# EAGLE schematic controller_old (EAGLE 9.0.0)

## Sheet 1 of 6
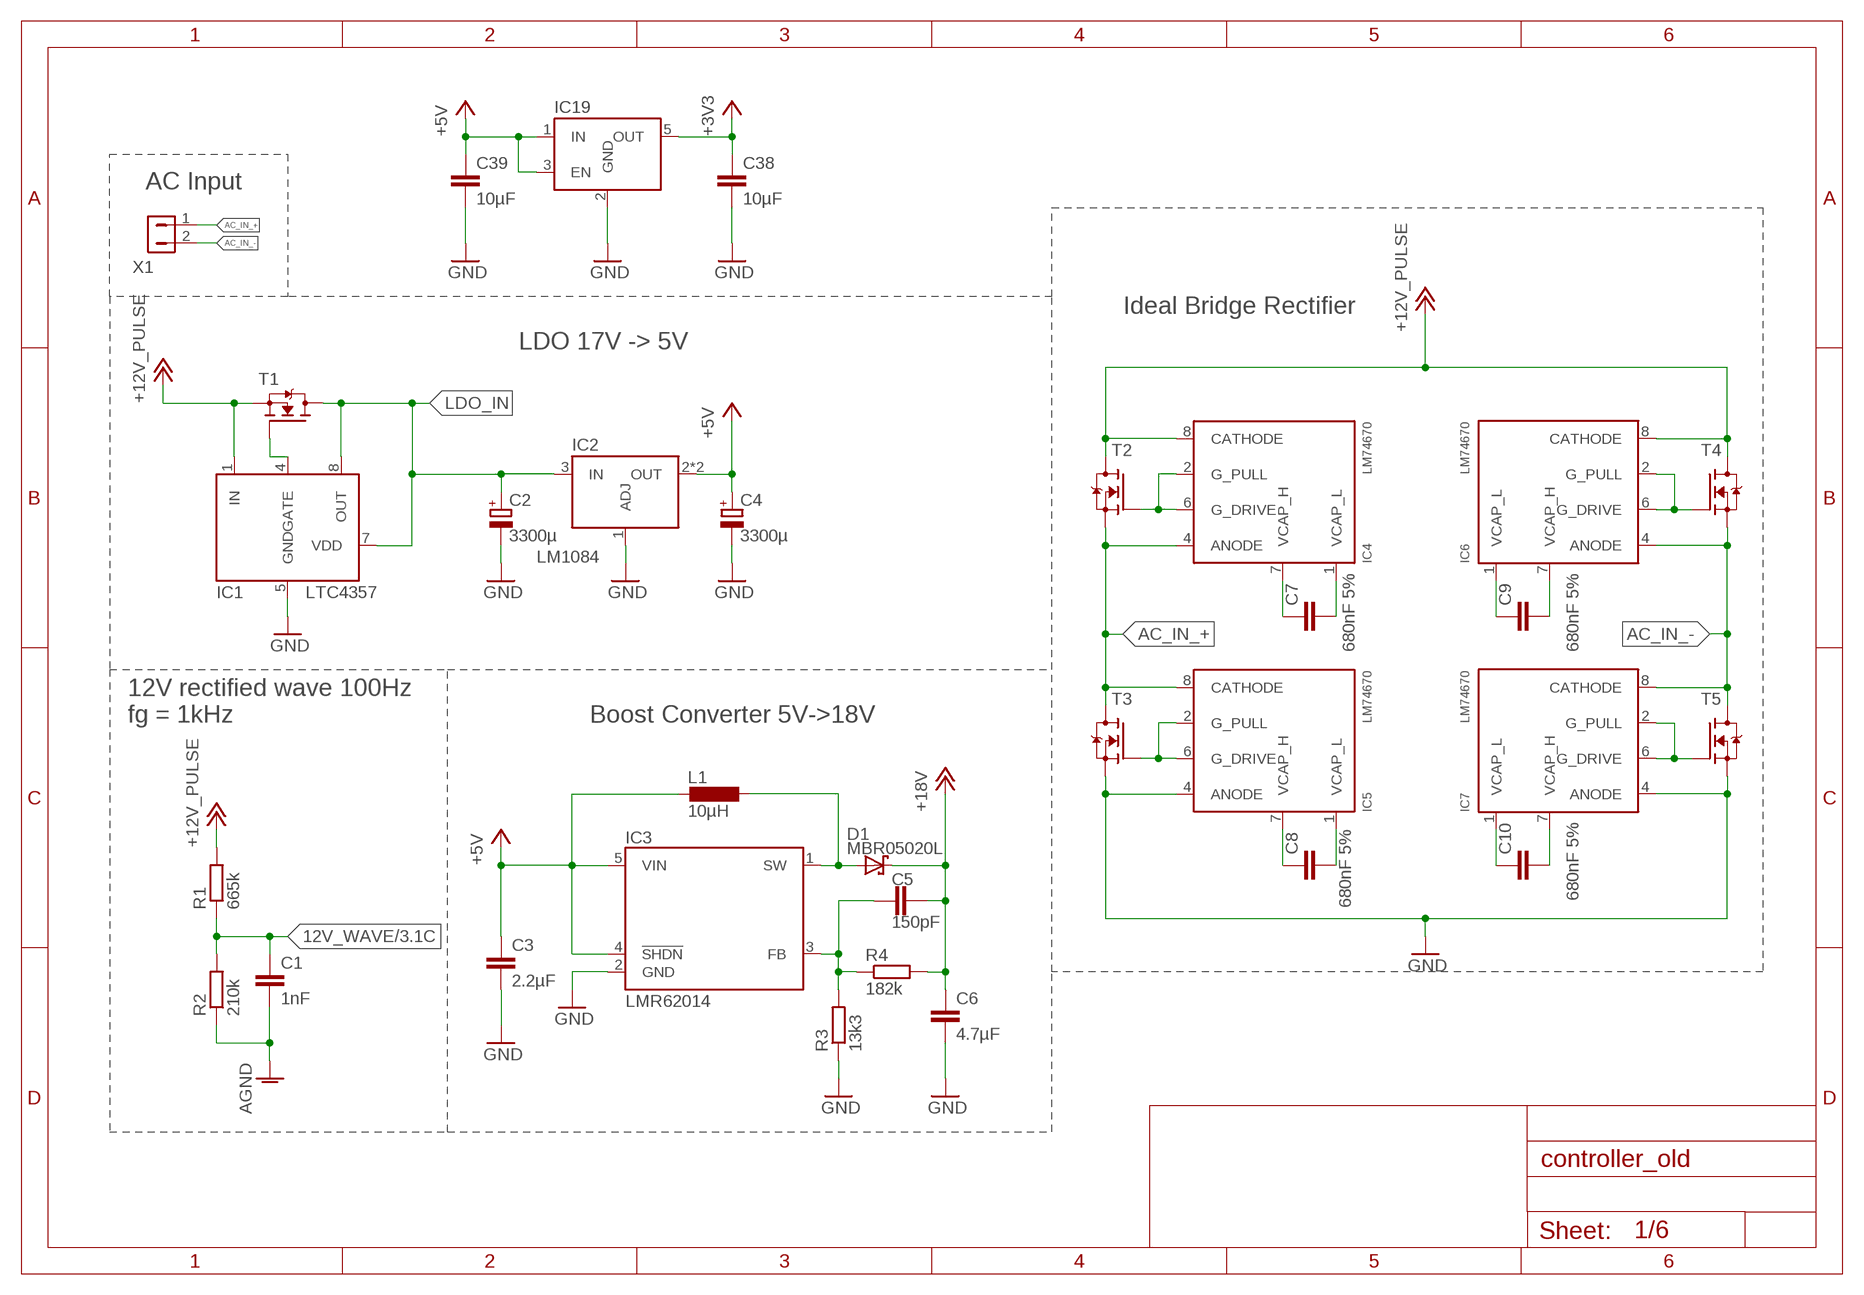
[diagram p0: schematic, sheet 1]

### Parts
C1  1nF  C-EUC0603  [C0603]
C2  3300µ  C-EEVFK  [C_EEVFK]
C3  2.2µF  C-EUC0805  [C0805]
C4  3300µ  C-EEVFK  [C_EEVFK]
C5  150pF  C-EUC0805  [C0805]
C6  4.7µF  C-EUC0805  [C0805]
C7  680nF 5%  C-EUC0805  [C0805]
C8  680nF 5%  C-EUC0805  [C0805]
C9  680nF 5%  C-EUC0805  [C0805]
C10  680nF 5%  C-EUC0805  [C0805]
C38  10µF  C-EUC0805  [C0805]
C39  10µF  C-EUC0805  [C0805]
D1  MBR05020L  [SOD-123]
IC1  LTC4357  [MSOP8]
IC2  LM1084  [TO263]
IC3  LMR62014  [SOT23-5L]
IC4  LM74670  [VSSOP-8]
IC5  LM74670  [VSSOP-8]
IC6  LM74670  [VSSOP-8]
IC7  LM74670  [VSSOP-8]
IC19  MIC5504  [SOT23-5L]
L1  10µH  WE-TPC  [WE-TPC]
R1  665k  R-EU_R0603  [R0603]
R2  210k  R-EU_R0603  [R0603]
R3  13k3  R-EU_R0805  [R0805]
R4  182k  R-EU_R0805  [R0805]
T1  FDS6670A  [SO8]
T2  PSMN1R0  [LFPAK56-5]
T3  PSMN1R0  [LFPAK56-5]
T4  PSMN1R0  [LFPAK56-5]
T5  PSMN1R0  [LFPAK56-5]
X1  ULTRAFIT-20  [ULTRAFIT-2]

### Nets
12V_WAVE: C1.1 R1.1 R2.2 ; also sheet 3
+3V3: C38.1 IC19.5(OUT) ; also sheet 4,6
+5V: C3.1 C4.+ C39.1 IC2.2(OUT) IC2.4(OUT) IC3.4(!SHDN!) IC3.5(VIN) IC19.1(IN) IC19.3(EN) L1.2 ; also sheet 2,3,4,5,6
+12V_PULSE: IC1.1(IN) IC4.8(CATHODE) IC6.8(CATHODE) R1.2 T1.1(S) T1.2(S) T1.3(S) T2.5(D) T4.5(D) ; also sheet 2,4,6
+18V [+18V]: C5.1 C6.1 D1.1(C) R4.2 ; also sheet 2,6
AC_IN_+: IC4.4(ANODE) IC5.8(CATHODE) T2.1(S) T2.2(S) T2.3(S) T3.5(D) X1.1
AC_IN_-: IC6.4(ANODE) IC7.8(CATHODE) T4.1(S) T4.2(S) T4.3(S) T5.5(D) X1.2
AGND: C1.2 R2.1 ; also sheet 3,5
BOOST_FB: C5.2 IC3.3(FB) R3.2 R4.1
BOOST_SW: D1.2(A) IC3.1(SW) L1.1
DIODE_G: IC1.4(GATE) T1.4(G)
GND: C2.- C3.2 C4.- C6.2 C38.2 C39.2 IC1.5(GND) IC2.1(ADJ) IC3.2(GND) IC5.4(ANODE) IC7.4(ANODE) IC19.2(GND) R3.1 T3.1(S) T3.2(S) T3.3(S) T5.1(S) T5.2(S) T5.3(S) ; also sheet 2,3,4,6
LDO_IN: C2.+ IC1.7(VDD) IC1.8(OUT) IC2.3(IN) T1.5(D) T1.6(D) T1.7(D) T1.8(D)
RECT_D1_CAP_H1: C7.1 IC4.7(VCAP_H)
RECT_D1_CAP_L1: C7.2 IC4.1(VCAP_L)
RECT_D1_G1: IC4.2(G_PULL) IC4.6(G_DRIVE) T2.4(G)
RECT_D2_CAP_H1: C9.2 IC6.1(VCAP_L)
RECT_D2_CAP_L1: C9.1 IC6.7(VCAP_H)
RECT_D2_G1: IC6.2(G_PULL) IC6.6(G_DRIVE) T4.4(G)
RECT_D3_CAP_H1: C8.1 IC5.7(VCAP_H)
RECT_D3_CAP_L1: C8.2 IC5.1(VCAP_L)
RECT_D3_G1: IC5.2(G_PULL) IC5.6(G_DRIVE) T3.4(G)
RECT_D4_CAP_H1: C10.2 IC7.1(VCAP_L)
RECT_D4_CAP_L1: C10.1 IC7.7(VCAP_H)
RECT_D4_G1: IC7.2(G_PULL) IC7.6(G_DRIVE) T5.4(G)

### Notes on the sheet
- AC Input
- Ideal Bridge Rectifier
- LDO 17V -> 5V
- 12V rectified wave 100Hz 
  fg = 1kHz
- Boost Converter 5V->18V

## Sheet 2 of 6
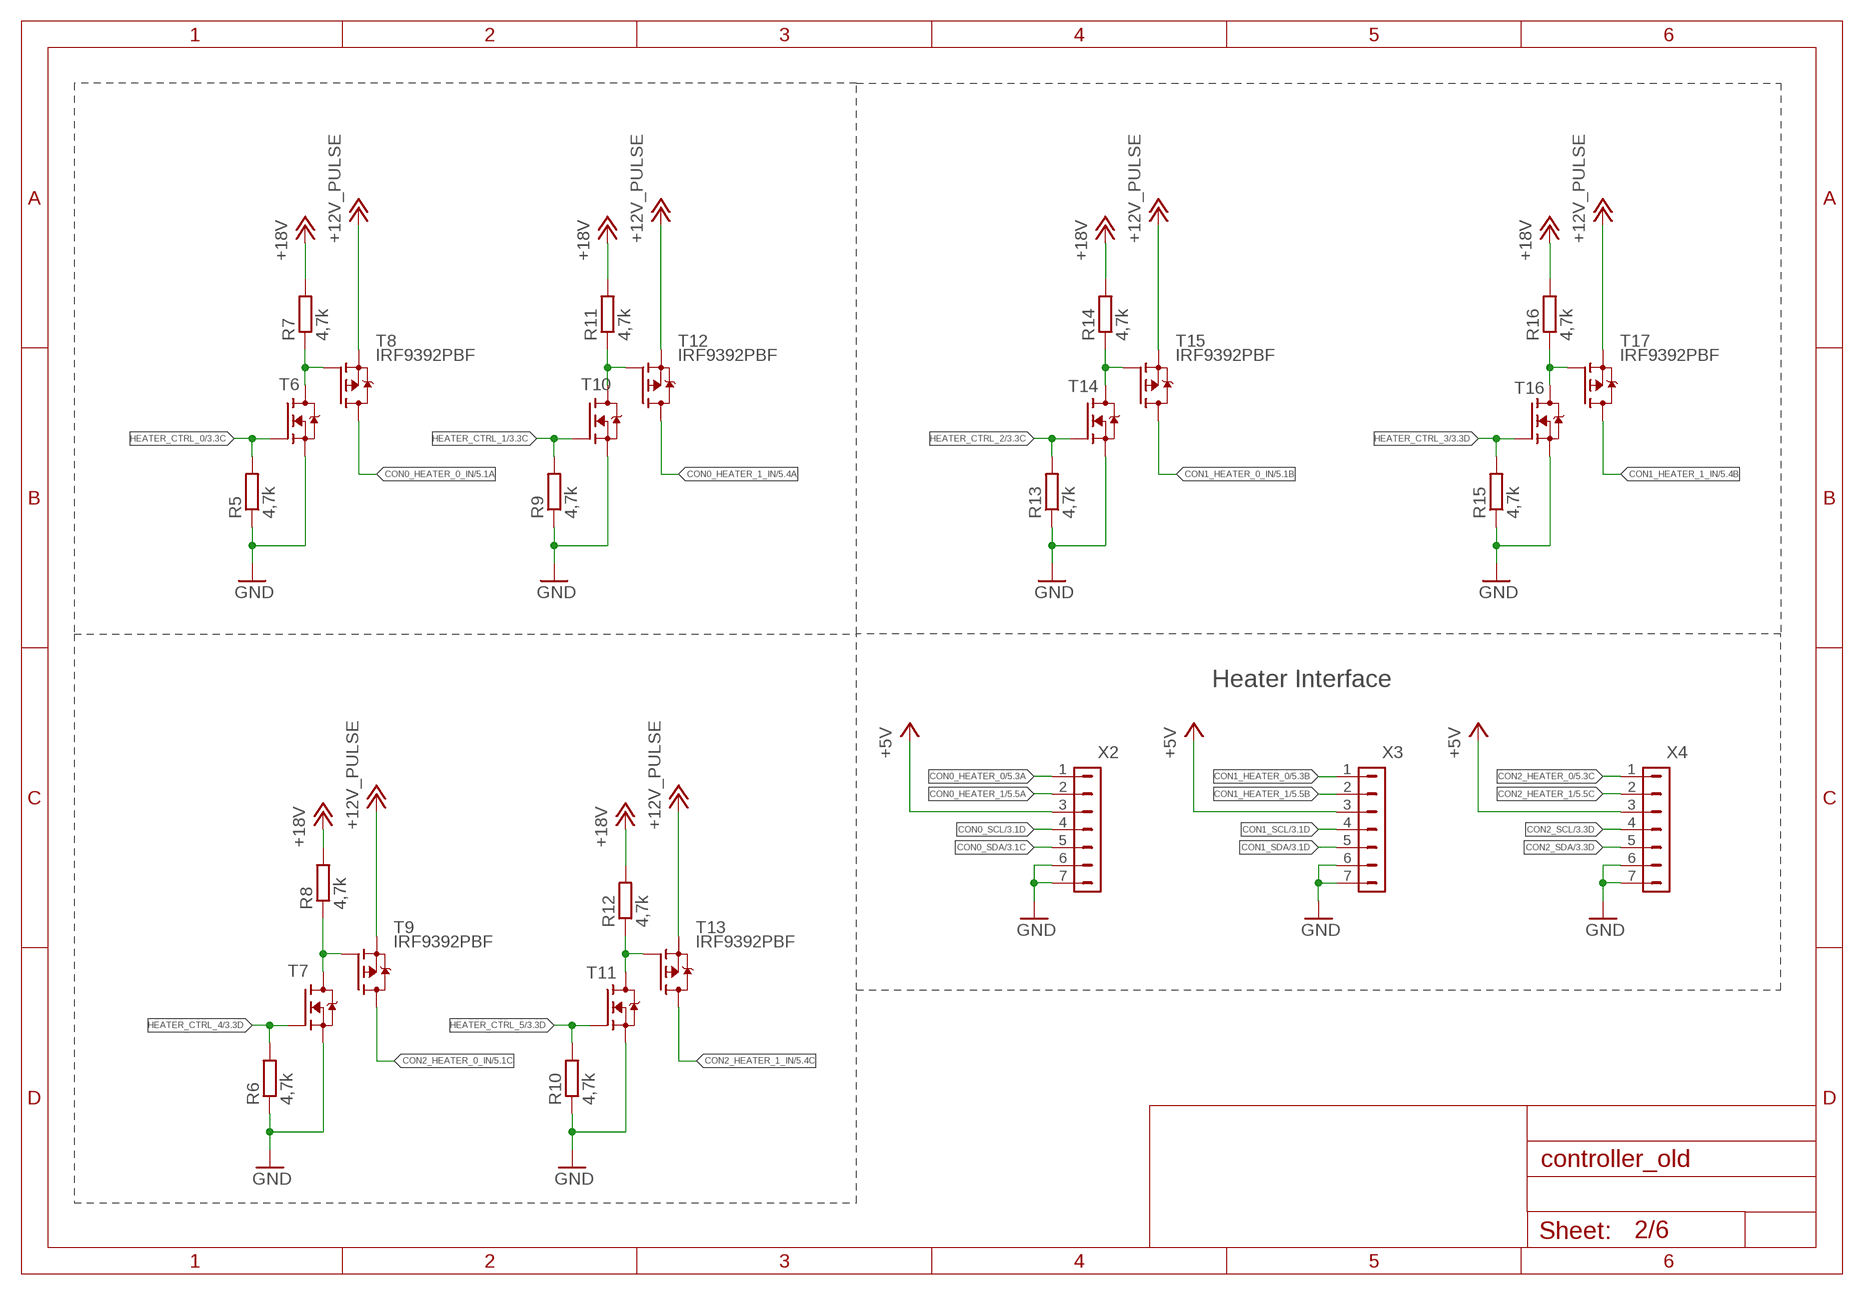
[diagram p1: schematic, sheet 2]

### Parts
R5  4,7k  R-EU_R0805  [R0805]
R6  4,7k  R-EU_R0805  [R0805]
R7  4,7k  R-EU_R0805  [R0805]
R8  4,7k  R-EU_R0805  [R0805]
R9  4,7k  R-EU_R0805  [R0805]
R10  4,7k  R-EU_R0805  [R0805]
R11  4,7k  R-EU_R0805  [R0805]
R12  4,7k  R-EU_R0805  [R0805]
R13  4,7k  R-EU_R0805  [R0805]
R14  4,7k  R-EU_R0805  [R0805]
R15  4,7k  R-EU_R0805  [R0805]
R16  4,7k  R-EU_R0805  [R0805]
T6  NVR4003NT3G  [SOT23]
T7  NVR4003NT3G  [SOT23]
T8  IRF9392PBF  [SO8]
T9  IRF9392PBF  [SO8]
T10  NVR4003NT3G  [SOT23]
T11  NVR4003NT3G  [SOT23]
T12  IRF9392PBF  [SO8]
T13  IRF9392PBF  [SO8]
T14  NVR4003NT3G  [SOT23]
T15  IRF9392PBF  [SO8]
T16  NVR4003NT3G  [SOT23]
T17  IRF9392PBF  [SO8]
X2  NANOFIT-7  [NANOFIT-7]
X3  NANOFIT-7  [NANOFIT-7]
X4  NANOFIT-7  [NANOFIT-7]

### Nets
+5V: X2.3 X3.3 X4.3 ; also sheet 1,3,4,5,6
+12V_PULSE: T8.1(S) T8.2(S) T8.3(S) T9.1(S) T9.2(S) T9.3(S) T12.1(S) T12.2(S) T12.3(S) T13.1(S) T13.2(S) T13.3(S) T15.1(S) T15.2(S) T15.3(S) T17.1(S) T17.2(S) T17.3(S) ; also sheet 1,4,6
+18V [+18V]: R7.2 R8.2 R11.2 R12.2 R14.2 R16.2 ; also sheet 1,6
CON0_HEATER_0: X2.1 ; also sheet 5
CON0_HEATER_0_IN: T8.5(D) T8.6(D) T8.7(D) T8.8(D) ; also sheet 5
CON0_HEATER_1: X2.2 ; also sheet 5
CON0_HEATER_1_IN: T12.5(D) T12.6(D) T12.7(D) T12.8(D) ; also sheet 5
CON0_SCL: X2.4 ; also sheet 3,6
CON0_SDA: X2.5 ; also sheet 3,6
CON1_HEATER_0: X3.1 ; also sheet 5
CON1_HEATER_0_IN: T15.5(D) T15.6(D) T15.7(D) T15.8(D) ; also sheet 5
CON1_HEATER_1: X3.2 ; also sheet 5
CON1_HEATER_1_IN: T17.5(D) T17.6(D) T17.7(D) T17.8(D) ; also sheet 5
CON1_SCL: X3.4 ; also sheet 3,6
CON1_SDA: X3.5 ; also sheet 3,6
CON2_HEATER_0: X4.1 ; also sheet 5
CON2_HEATER_0_IN: T9.5(D) T9.6(D) T9.7(D) T9.8(D) ; also sheet 5
CON2_HEATER_1: X4.2 ; also sheet 5
CON2_HEATER_1_IN: T13.5(D) T13.6(D) T13.7(D) T13.8(D) ; also sheet 5
CON2_SCL: X4.4 ; also sheet 3,6
CON2_SDA: X4.5 ; also sheet 3,6
GND: R5.1 R6.1 R9.1 R10.1 R13.1 R15.1 T6.2(S) T7.2(S) T10.2(S) T11.2(S) T14.2(S) T16.2(S) X2.6 X2.7 X3.6 X3.7 X4.6 X4.7 ; also sheet 1,3,4,6
HEATER0_G0: R7.1 T6.3(D) T8.4(G)
HEATER0_G1: R11.1 T10.3(D) T12.4(G)
HEATER1_G0: R14.1 T14.3(D) T15.4(G)
HEATER1_G1: R16.1 T16.3(D) T17.4(G)
HEATER2_G0: R8.1 T7.3(D) T9.4(G)
HEATER2_G1: R12.1 T11.3(D) T13.4(G)
HEATER_CTRL_0: R5.2 T6.1(G) ; also sheet 3
HEATER_CTRL_1: R9.2 T10.1(G) ; also sheet 3
HEATER_CTRL_2: R13.2 T14.1(G) ; also sheet 3
HEATER_CTRL_3: R15.2 T16.1(G) ; also sheet 3
HEATER_CTRL_4: R6.2 T7.1(G) ; also sheet 3
HEATER_CTRL_5: R10.2 T11.1(G) ; also sheet 3

### Notes on the sheet
- Heater Interface

## Sheet 3 of 6
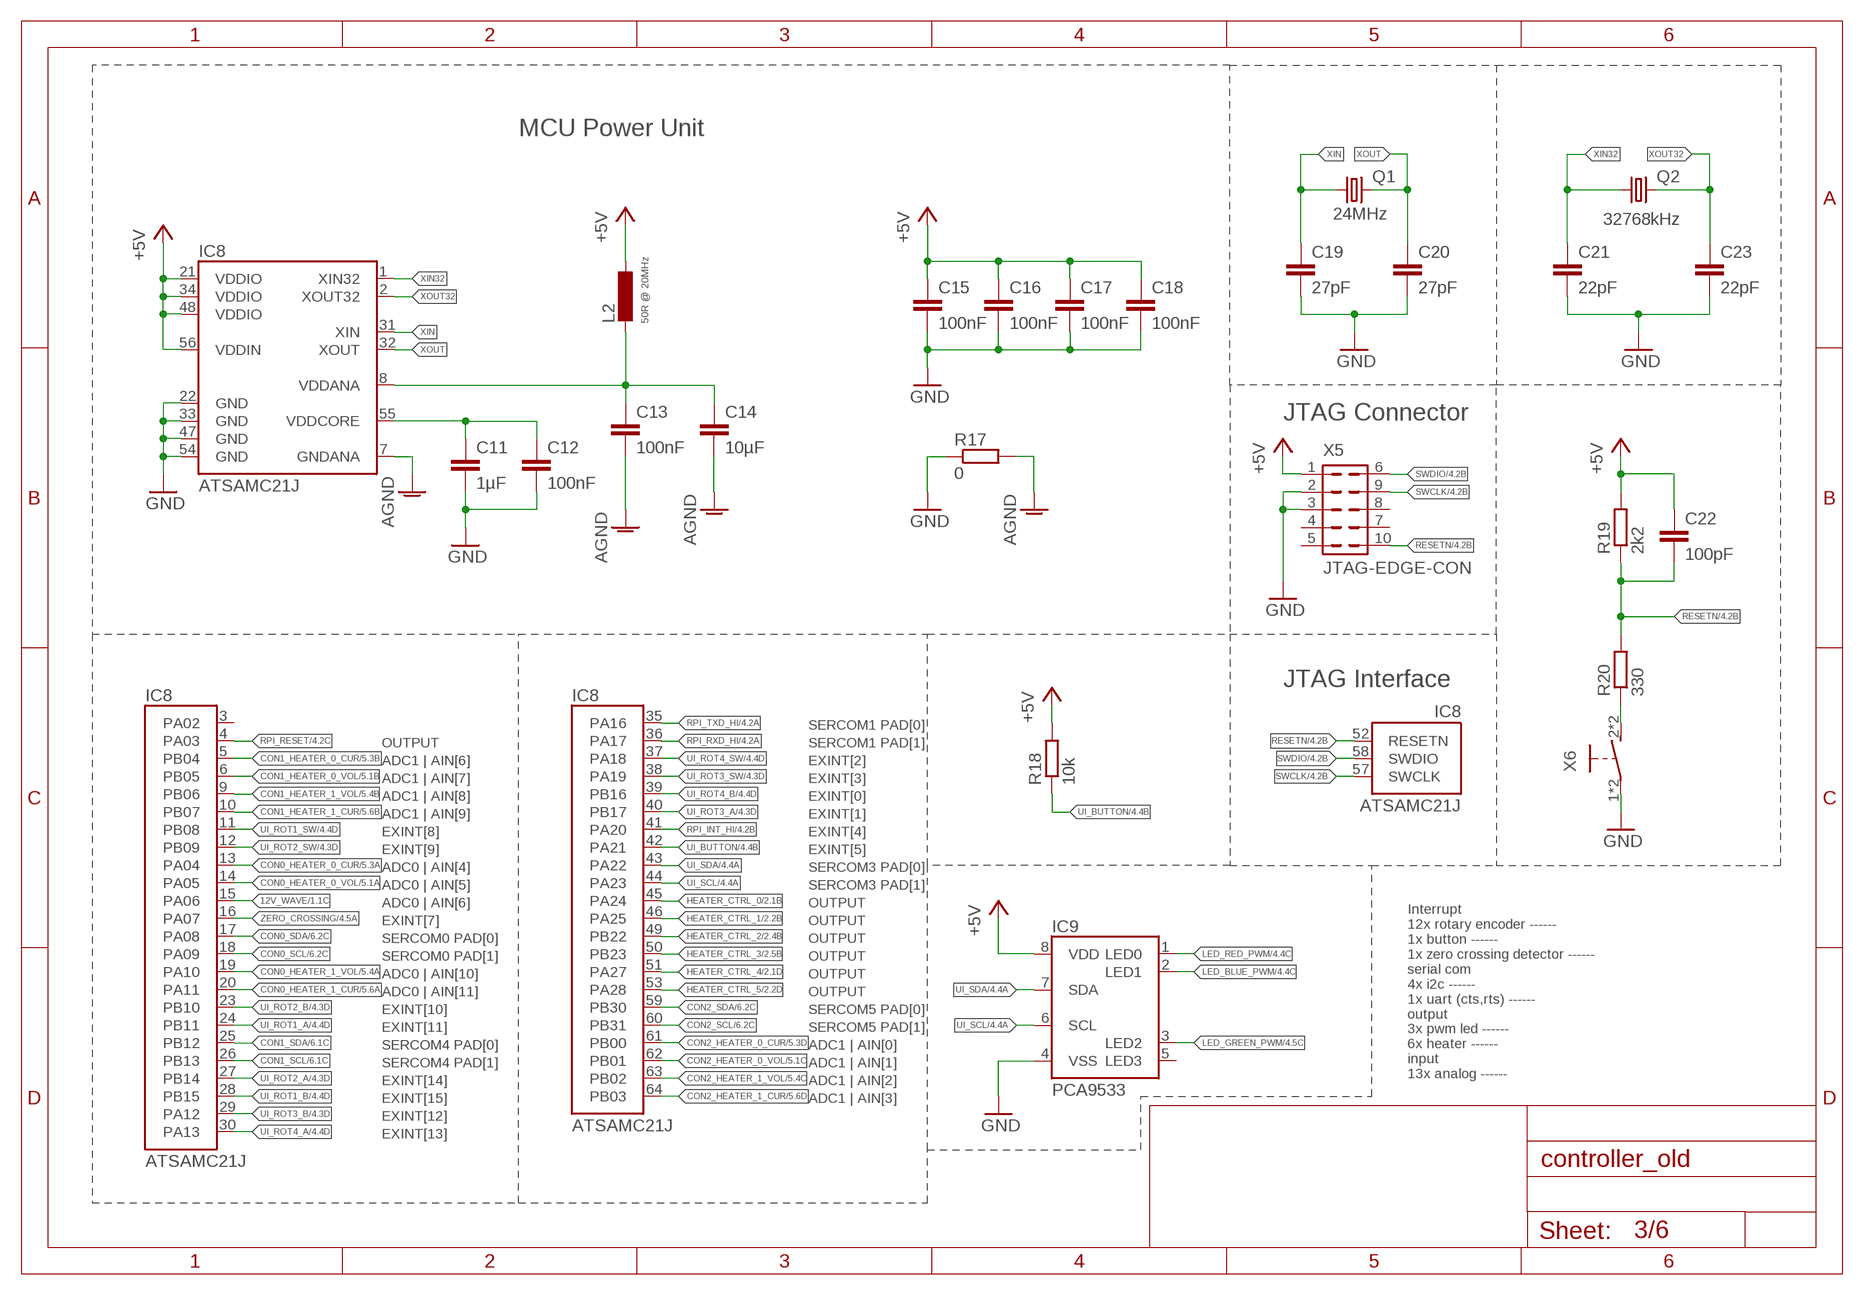
[diagram p2: schematic, sheet 3]

### Parts
C11  1µF  C-EUC0402  [C0402]
C12  100nF  C-EUC0402  [C0402]
C13  100nF  C-EUC0402  [C0402]
C14  10µF  C-EUC0805  [C0805]
C15  100nF  C-EUC0402  [C0402]
C16  100nF  C-EUC0402  [C0402]
C17  100nF  C-EUC0402  [C0402]
C18  100nF  C-EUC0402  [C0402]
C19  27pF  C-EUC0402  [C0402]
C20  27pF  C-EUC0402  [C0402]
C21  22pF  C-EUC0402  [C0402]
C22  100pF  C-EUC0603  [C0603]
C23  22pF  C-EUC0402  [C0402]
IC8  ATSAMC21J  [TQFP64-10X10]
IC9  PCA9533  [TSSOP8]
L2  50R @ 20MHz  L-0603  [L0603]
Q1  24MHz  7A-SERIES  [5X3.2]
Q2  32768kHz  9HT11  [2X1.2]
R17  0  R-EU_R1210  [R1210]
R18  10k  R-EU_R0603  [R0603]
R19  2k2  R-EU_R0603  [R0603]
R20  330  R-EU_R0603  [R0603]
X5  JTAG-EDGE-CON  [DEBUG-CON]
X6  B3S-1000  [B3S]

### Nets
12V_WAVE: IC8.15(PA06) ; also sheet 1
+5V: C15.1 C16.1 C17.1 C18.1 C22.1 IC8.21(VDDIO) IC8.34(VDDIO) IC8.48(VDDIO) IC8.56(VDDIN) IC9.8(VDD) L2.1 R18.2 R19.2 X5.1 ; also sheet 1,2,4,5,6
AGND: C13.2 C14.2 IC8.7(GNDANA) R17.2 ; also sheet 1,5
CON0_HEATER_0_CUR: IC8.13(PA04) ; also sheet 5
CON0_HEATER_0_VOL: IC8.14(PA05) ; also sheet 5
CON0_HEATER_1_CUR: IC8.20(PA11) ; also sheet 5
CON0_HEATER_1_VOL: IC8.19(PA10) ; also sheet 5
CON0_SCL: IC8.18(PA09) ; also sheet 2,6
CON0_SDA: IC8.17(PA08) ; also sheet 2,6
CON1_HEATER_0_CUR: IC8.5(PB04) ; also sheet 5
CON1_HEATER_0_VOL: IC8.6(PB05) ; also sheet 5
CON1_HEATER_1_CUR: IC8.10(PB07) ; also sheet 5
CON1_HEATER_1_VOL: IC8.9(PB06) ; also sheet 5
CON1_SCL: IC8.26(PB13) ; also sheet 2,6
CON1_SDA: IC8.25(PB12) ; also sheet 2,6
CON2_HEATER_0_CUR: IC8.61(PB00) ; also sheet 5
CON2_HEATER_0_VOL: IC8.62(PB01) ; also sheet 5
CON2_HEATER_1_CUR: IC8.64(PB03) ; also sheet 5
CON2_HEATER_1_VOL: IC8.63(PB02) ; also sheet 5
CON2_SCL: IC8.60(PB31) ; also sheet 2,6
CON2_SDA: IC8.59(PB30) ; also sheet 2,6
GND: C11.2 C12.2 C15.2 C16.2 C17.2 C18.2 C19.2 C20.2 C21.2 C23.2 IC8.22(GND) IC8.33(GND) IC8.47(GND) IC8.54(GND) IC9.4(VSS) R17.1 X5.2 X5.3 X6.1(P) X6.3(P) ; also sheet 1,2,4,6
HEATER_CTRL_0: IC8.45(PA24) ; also sheet 2
HEATER_CTRL_1: IC8.46(PA25) ; also sheet 2
HEATER_CTRL_2: IC8.49(PB22) ; also sheet 2
HEATER_CTRL_3: IC8.50(PB23) ; also sheet 2
HEATER_CTRL_4: IC8.51(PA27) ; also sheet 2
HEATER_CTRL_5: IC8.53(PA28) ; also sheet 2
LED_BLUE_PWM: IC9.2(LED1) ; also sheet 4
LED_GREEN_PWM: IC9.3(LED2) ; also sheet 4
LED_RED_PWM: IC9.1(LED0) ; also sheet 4
RESET_SW_IN: R20.1 X6.2(S) X6.4(S)
RESETN: C22.2 IC8.52(RESETN) R19.1 R20.2 X5.10 ; also sheet 4
RPI_INT_HI: IC8.41(PA20) ; also sheet 4
RPI_RESET: IC8.4(PA03) ; also sheet 4
RPI_RXD_HI: IC8.36(PA17) ; also sheet 4,6
RPI_TXD_HI: IC8.35(PA16) ; also sheet 4,6
SWCLK: IC8.57(SWCLK) X5.9 ; also sheet 4
SWDIO: IC8.58(SWDIO) X5.6 ; also sheet 4
UI_BUTTON: IC8.42(PA21) R18.1 ; also sheet 4
UI_ROT1_A: IC8.24(PB11) ; also sheet 4
UI_ROT1_B: IC8.28(PB15) ; also sheet 4
UI_ROT1_SW: IC8.11(PB08) ; also sheet 4
UI_ROT2_A: IC8.27(PB14) ; also sheet 4
UI_ROT2_B: IC8.23(PB10) ; also sheet 4
UI_ROT2_SW: IC8.12(PB09) ; also sheet 4
UI_ROT3_A: IC8.40(PB17) ; also sheet 4
UI_ROT3_B: IC8.29(PA12) ; also sheet 4
UI_ROT3_SW: IC8.38(PA19) ; also sheet 4
UI_ROT4_A: IC8.30(PA13) ; also sheet 4
UI_ROT4_B: IC8.39(PB16) ; also sheet 4
UI_ROT4_SW: IC8.37(PA18) ; also sheet 4
UI_SCL: IC8.44(PA23) IC9.6(SCL) ; also sheet 4,6
UI_SDA: IC8.43(PA22) IC9.7(SDA) ; also sheet 4,6
VDDANA: C13.1 C14.1 IC8.8(VDDANA) L2.2
VDDCORE: C11.1 C12.1 IC8.55(VDDCORE)
XIN: C19.1 IC8.31(XIN) Q1.1
XIN32: C21.1 IC8.1(XIN32) Q2.1
XOUT: C20.1 IC8.32(XOUT) Q1.2
XOUT32: C23.1 IC8.2(XOUT32) Q2.2
ZERO_CROSSING: IC8.16(PA07) ; also sheet 4,6
Unconnected: IC8.3(PA02) IC9.5(LED3) X5.4 X5.5 X5.7 X5.8

### Notes on the sheet
- MCU Power Unit
- JTAG Connector
- JTAG Interface
- SERCOM1 PAD[0]
- OUTPUT | SERCOM1 PAD[1]
- ADC1 | AIN[6] | EXINT[2]
- ADC1 | AIN[7] | EXINT[3]
- ADC1 | AIN[8] | EXINT[0]
- ADC1 | AIN[9] | EXINT[1]
- EXINT[8] | EXINT[4]
- EXINT[9] | EXINT[5]
- ADC0 | AIN[4] | SERCOM3 PAD[0]
- ADC0 | AIN[5] | SERCOM3 PAD[1]
- ADC0 | AIN[6] | OUTPUT
- EXINT[7] | OUTPUT
- SERCOM0 PAD[0] | OUTPUT
- SERCOM0 PAD[1] | OUTPUT
- ADC0 | AIN[10] | OUTPUT
- ADC0 | AIN[11] | OUTPUT
- EXINT[10] | SERCOM5 PAD[0]
- EXINT[11] | SERCOM5 PAD[1]
- SERCOM4 PAD[0] | ADC1 | AIN[0]
- SERCOM4 PAD[1] | ADC1 | AIN[1]
- Interrupt
  12x rotary encoder ------
  1x button ------
  1x zero crossing detector ------
  serial com
  4x i2c ------
  1x uart (cts,rts) ------
  output
  3x pwm led ------
  6x heater ------
  input
  13x analog ------
- EXINT[14] | ADC1 | AIN[2]
- EXINT[15] | ADC1 | AIN[3]
- EXINT[12]
- EXINT[13]

## Sheet 4 of 6
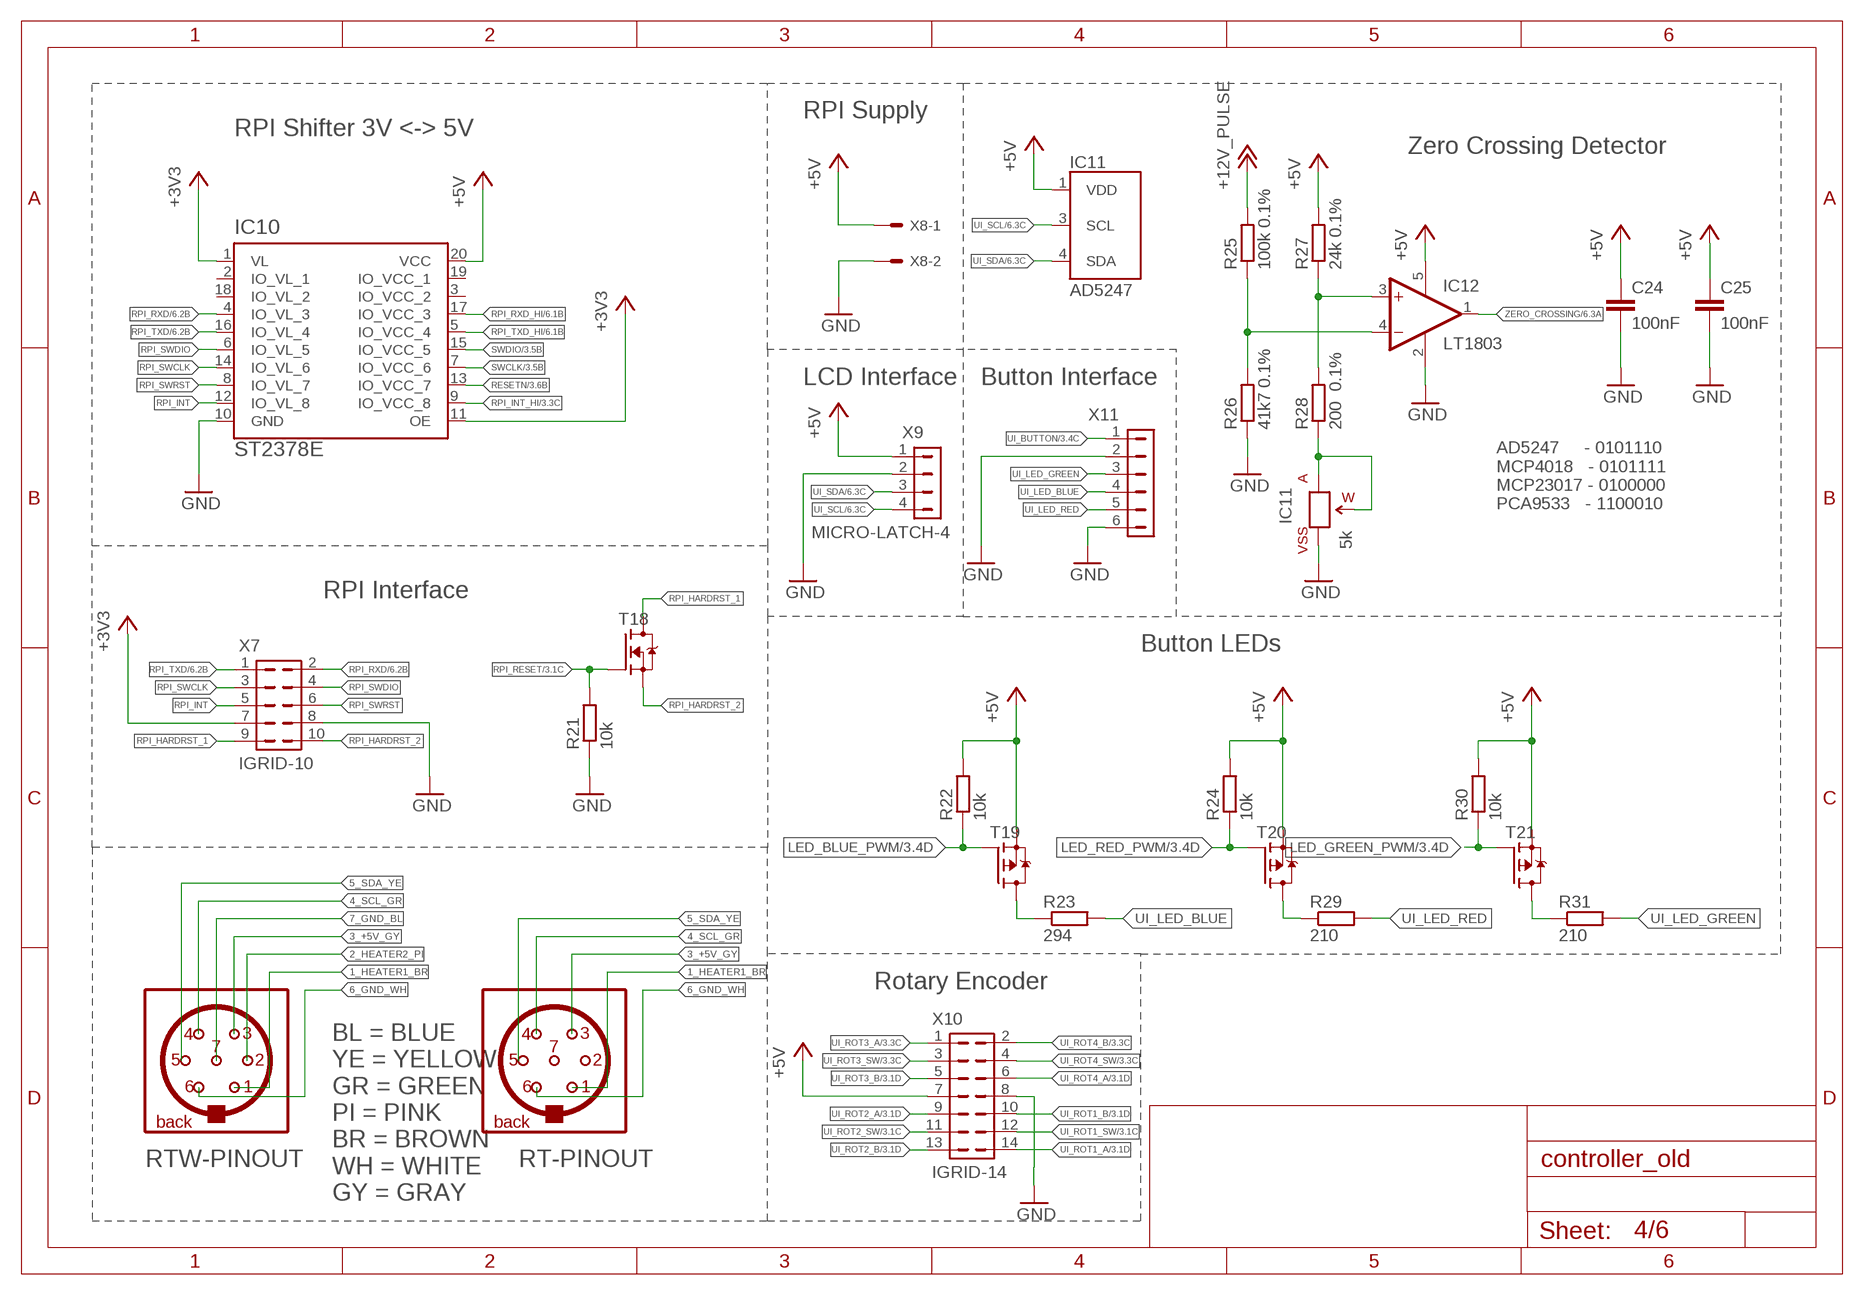
[diagram p3: schematic, sheet 4]

### Parts
C24  100nF  C-EUC0603  [C0603]
C25  100nF  C-EUC0603  [C0603]
CON1  BINDER-IP40  (no package)
CON2  BINDER-IP40  (no package)
IC10  ST2378E  [TSSOP20]
IC11  5k  AD5247BKSZ5-RL7  [SC70-6L]
IC12  LT1803  [SOT23-5L]
R21  10k  R-EU_R0603  [R0603]
R22  10k  R-EU_R0603  [R0603]
R23  294  R-EU_R0805  [R0805]
R24  10k  R-EU_R0603  [R0603]
R25  100k 0.1%  R-EU_R0603  [R0603]
R26  41k7 0.1%  R-EU_R0603  [R0603]
R27  24k 0.1%  R-EU_R0603  [R0603]
R28  200 0.1%  R-EU_R0603  [R0603]
R29  210  R-EU_R0805  [R0805]
R30  10k  R-EU_R0603  [R0603]
R31  210  R-EU_R0805  [R0805]
T18  BSS7728NH6327XTSA1  [SOT23]
T19  BSS84PH6433XTMA1  [SOT23]
T20  BSS84PH6433XTMA1  [SOT23]
T21  BSS84PH6433XTMA1  [SOT23]
X7  IGRID-10  [I-GRID-10]
X8  KK-156-2  [KK-156-2]
X9  MICRO-LATCH-4  [MICRO-LATCH-4]
X10  IGRID-14  [I-GRID-14]
X11  MICRO-CLASP-6  [MICRO-CLASP-6]

### Nets
1_HEATER1_BR: CON1.1 CON2.1
3_+5V_GY: CON1.3 CON2.3
4_SCL_GR: CON1.4 CON2.4
6_GND_WH: CON1.6 CON2.6
7_GND_BL: CON1.7
+3V3: IC10.1(VL) IC10.11(OE) X7.7 ; also sheet 1,6
+5V: C24.1 C25.1 IC10.20(VCC) IC11.1(VDD) IC12.5(V+) R22.2 R24.2 R27.2 R30.2 T19.2(S) T20.2(S) T21.2(S) X8.1 X9.1 X10.7 ; also sheet 1,2,3,5,6
+12V_PULSE: R25.2 ; also sheet 1,2,6
GND: C24.2 C25.2 IC10.10(GND) IC11.2(VSS) IC12.2(V-) R21.1 R26.1 X7.8 X8.2 X9.2 X10.8 X11.2 X11.6 ; also sheet 1,2,3,6
LED_BLUE_D: R23.1 T19.3(D)
LED_BLUE_PWM: R22.1 T19.1(G) ; also sheet 3
LED_GREEN_D: R31.1 T21.3(D)
LED_GREEN_PWM: R30.1 T21.1(G) ; also sheet 3
LED_RED_D: R29.1 T20.3(D)
LED_RED_PWM: R24.1 T20.1(G) ; also sheet 3
RESETN: IC10.13(IO_VCC_7) ; also sheet 3
RPI_HARDRST_1: T18.3(D) X7.9
RPI_HARDRST_2: T18.2(S) X7.10
RPI_INT: IC10.12(IO_VL_8) X7.5
RPI_INT_HI: IC10.9(IO_VCC_8) ; also sheet 3
RPI_RESET: R21.2 T18.1(G) ; also sheet 3
RPI_RXD: IC10.4(IO_VL_3) X7.2 ; also sheet 6
RPI_RXD_HI: IC10.17(IO_VCC_3) ; also sheet 3,6
RPI_SWCLK: IC10.14(IO_VL_6) X7.3
RPI_SWDIO: IC10.6(IO_VL_5) X7.4
RPI_SWRST: IC10.8(IO_VL_7) X7.6
RPI_TXD: IC10.16(IO_VL_4) X7.1 ; also sheet 6
RPI_TXD_HI: IC10.5(IO_VCC_4) ; also sheet 3,6
SWCLK: IC10.7(IO_VCC_6) ; also sheet 3
SWDIO: IC10.15(IO_VCC_5) ; also sheet 3
UI_BUTTON: X11.1 ; also sheet 3
UI_LED_BLUE: R23.2 X11.4
UI_LED_GREEN: R31.2 X11.3
UI_LED_RED: R29.2 X11.5
UI_ROT1_A: X10.14 ; also sheet 3
UI_ROT1_B: X10.10 ; also sheet 3
UI_ROT1_SW: X10.12 ; also sheet 3
UI_ROT2_A: X10.9 ; also sheet 3
UI_ROT2_B: X10.13 ; also sheet 3
UI_ROT2_SW: X10.11 ; also sheet 3
UI_ROT3_A: X10.1 ; also sheet 3
UI_ROT3_B: X10.5 ; also sheet 3
UI_ROT3_SW: X10.3 ; also sheet 3
UI_ROT4_A: X10.6 ; also sheet 3
UI_ROT4_B: X10.2 ; also sheet 3
UI_ROT4_SW: X10.4 ; also sheet 3
UI_SCL: IC11.3(SCL) X9.4 ; also sheet 3,6
UI_SDA: IC11.4(SDA) X9.3 ; also sheet 3,6
ZC_ADJ: IC11.5(W) IC11.6(A) R28.1
ZC_IN+: IC12.3(+IN) R27.1 R28.2
ZC_IN+-: IC12.4(-IN) R25.1 R26.2
ZERO_CROSSING: IC12.1(OUT) ; also sheet 3,6
Unconnected: CON1.2 CON1.5 CON2.2 CON2.5 CON2.7 IC10.2(IO_VL_1) IC10.3(IO_VCC_2) IC10.18(IO_VL_2) IC10.19(IO_VCC_1)

### Notes on the sheet
- RPI Supply
- RPI Shifter 3V <-> 5V
- Zero Crossing Detector
- AD5247
- LCD Interface | Button Interface
- AD5247     - 0101110
  MCP4018   - 0101111
  MCP23017 - 0100000
  PCA9533   - 1100010
- RPI Interface
- Button LEDs
- Rotary Encoder
- BL = BLUE
  YE = YELLOW
  GR = GREEN
  PI = PINK
  BR = BROWN
  WH = WHITE
  GY = GRAY
- RTW-PINOUT | RT-PINOUT

## Sheet 5 of 6
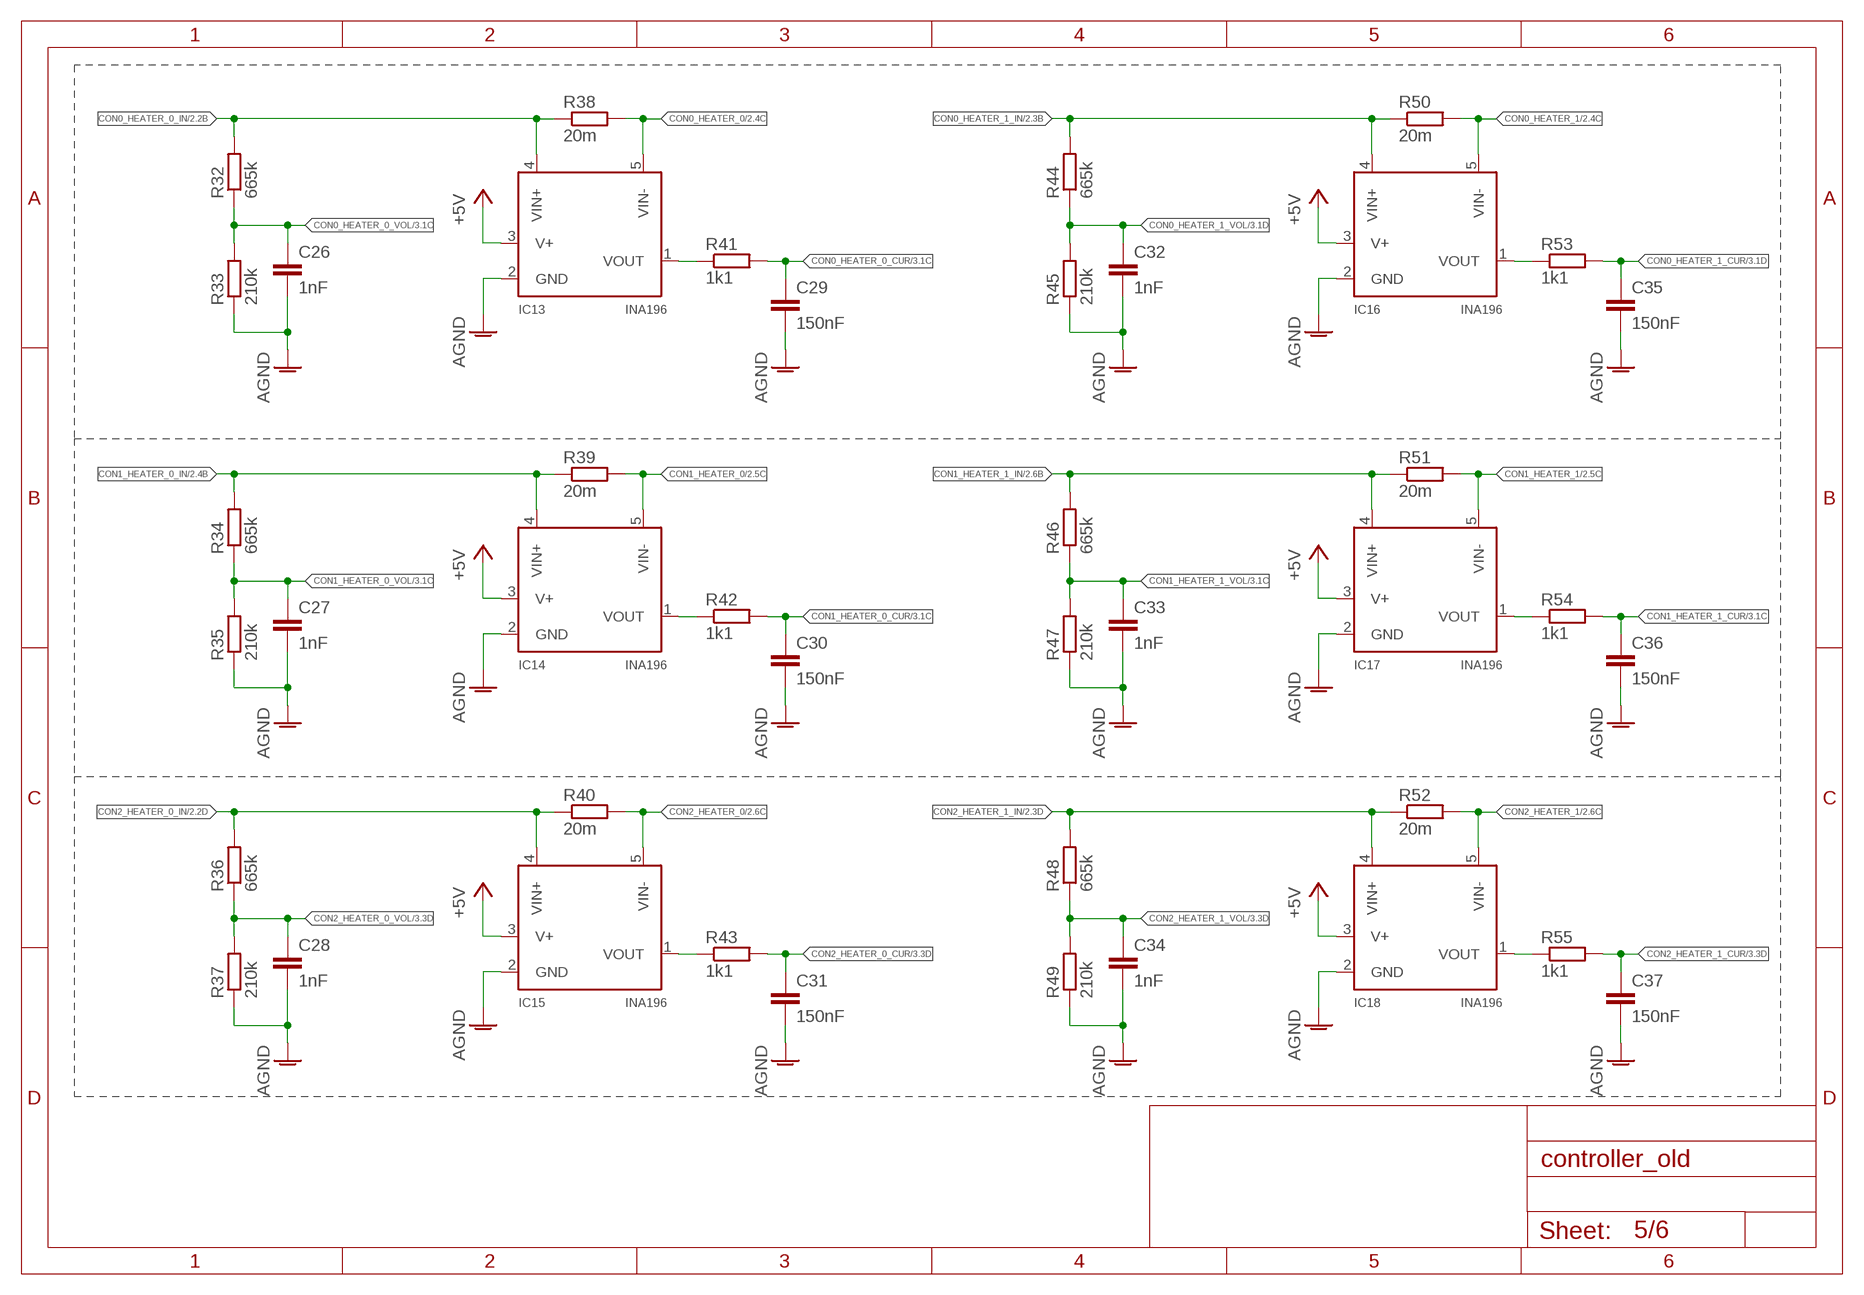
[diagram p4: schematic, sheet 5]

### Parts
C26  1nF  C-EUC0603  [C0603]
C27  1nF  C-EUC0603  [C0603]
C28  1nF  C-EUC0603  [C0603]
C29  150nF  C-EUC0603  [C0603]
C30  150nF  C-EUC0603  [C0603]
C31  150nF  C-EUC0603  [C0603]
C32  1nF  C-EUC0603  [C0603]
C33  1nF  C-EUC0603  [C0603]
C34  1nF  C-EUC0603  [C0603]
C35  150nF  C-EUC0603  [C0603]
C36  150nF  C-EUC0603  [C0603]
C37  150nF  C-EUC0603  [C0603]
IC13  INA196  [SOT23-5L]
IC14  INA196  [SOT23-5L]
IC15  INA196  [SOT23-5L]
IC16  INA196  [SOT23-5L]
IC17  INA196  [SOT23-5L]
IC18  INA196  [SOT23-5L]
R32  665k  R-EU_R0603  [R0603]
R33  210k  R-EU_R0603  [R0603]
R34  665k  R-EU_R0603  [R0603]
R35  210k  R-EU_R0603  [R0603]
R36  665k  R-EU_R0603  [R0603]
R37  210k  R-EU_R0603  [R0603]
R38  20m  R-EU_R1206  [R1206]
R39  20m  R-EU_R1206  [R1206]
R40  20m  R-EU_R1206  [R1206]
R41  1k1  R-EU_R0603  [R0603]
R42  1k1  R-EU_R0603  [R0603]
R43  1k1  R-EU_R0603  [R0603]
R44  665k  R-EU_R0603  [R0603]
R45  210k  R-EU_R0603  [R0603]
R46  665k  R-EU_R0603  [R0603]
R47  210k  R-EU_R0603  [R0603]
R48  665k  R-EU_R0603  [R0603]
R49  210k  R-EU_R0603  [R0603]
R50  20m  R-EU_R1206  [R1206]
R51  20m  R-EU_R1206  [R1206]
R52  20m  R-EU_R1206  [R1206]
R53  1k1  R-EU_R0603  [R0603]
R54  1k1  R-EU_R0603  [R0603]
R55  1k1  R-EU_R0603  [R0603]

### Nets
+5V: IC13.3(V+) IC14.3(V+) IC15.3(V+) IC16.3(V+) IC17.3(V+) IC18.3(V+) ; also sheet 1,2,3,4,6
AGND: C26.2 C27.2 C28.2 C29.2 C30.2 C31.2 C32.2 C33.2 C34.2 C35.2 C36.2 C37.2 IC13.2(GND) IC14.2(GND) IC15.2(GND) IC16.2(GND) IC17.2(GND) IC18.2(GND) R33.1 R35.1 R37.1 R45.1 R47.1 R49.1 ; also sheet 1,3
CON0_HEATER_0: IC13.5(VIN-) R38.2 ; also sheet 2
CON0_HEATER_0_CUR: C29.1 R41.2 ; also sheet 3
CON0_HEATER_0_IN: IC13.4(VIN+) R32.2 R38.1 ; also sheet 2
CON0_HEATER_0_VOL: C26.1 R32.1 R33.2 ; also sheet 3
CON0_HEATER_1: IC16.5(VIN-) R50.2 ; also sheet 2
CON0_HEATER_1_CUR: C35.1 R53.2 ; also sheet 3
CON0_HEATER_1_IN: IC16.4(VIN+) R44.2 R50.1 ; also sheet 2
CON0_HEATER_1_VOL: C32.1 R44.1 R45.2 ; also sheet 3
CON1_HEATER_0: IC14.5(VIN-) R39.2 ; also sheet 2
CON1_HEATER_0_CUR: C30.1 R42.2 ; also sheet 3
CON1_HEATER_0_IN: IC14.4(VIN+) R34.2 R39.1 ; also sheet 2
CON1_HEATER_0_VOL: C27.1 R34.1 R35.2 ; also sheet 3
CON1_HEATER_1: IC17.5(VIN-) R51.2 ; also sheet 2
CON1_HEATER_1_CUR: C36.1 R54.2 ; also sheet 3
CON1_HEATER_1_IN: IC17.4(VIN+) R46.2 R51.1 ; also sheet 2
CON1_HEATER_1_VOL: C33.1 R46.1 R47.2 ; also sheet 3
CON2_HEATER_0: IC15.5(VIN-) R40.2 ; also sheet 2
CON2_HEATER_0_CUR: C31.1 R43.2 ; also sheet 3
CON2_HEATER_0_IN: IC15.4(VIN+) R36.2 R40.1 ; also sheet 2
CON2_HEATER_0_VOL: C28.1 R36.1 R37.2 ; also sheet 3
CON2_HEATER_1: IC18.5(VIN-) R52.2 ; also sheet 2
CON2_HEATER_1_CUR: C37.1 R55.2 ; also sheet 3
CON2_HEATER_1_IN: IC18.4(VIN+) R48.2 R52.1 ; also sheet 2
CON2_HEATER_1_VOL: C34.1 R48.1 R49.2 ; also sheet 3
HEATER0_AD_OUT0: IC13.1(VOUT) R41.1
HEATER0_AD_OUT1: IC16.1(VOUT) R53.1
HEATER1_AD_OUT0: IC14.1(VOUT) R42.1
HEATER1_AD_OUT1: IC17.1(VOUT) R54.1
HEATER2_AD_OUT0: IC15.1(VOUT) R43.1
HEATER2_AD_OUT1: IC18.1(VOUT) R55.1

## Sheet 6 of 6
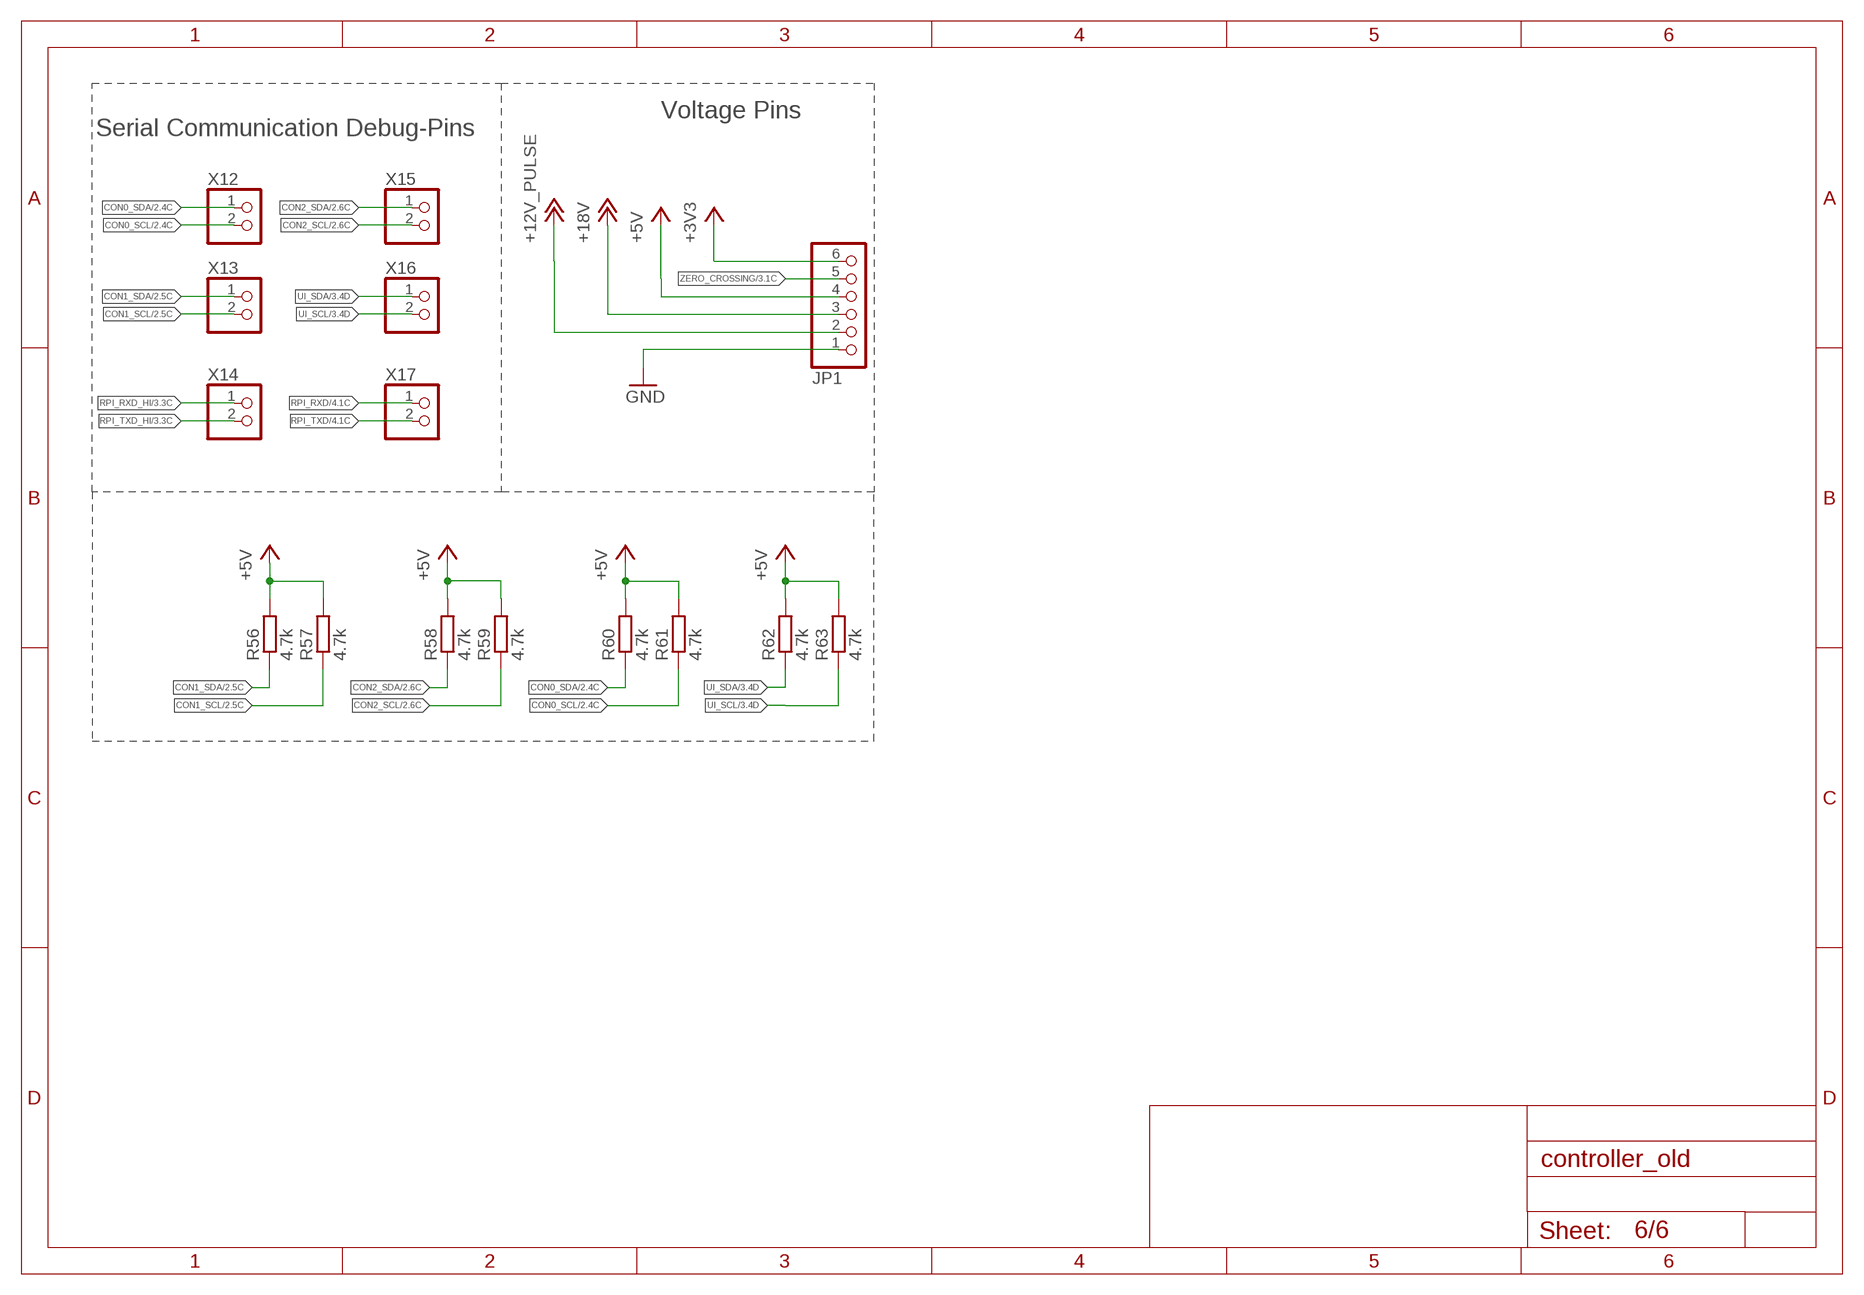
[diagram p5: schematic, sheet 6]

### Parts
JP1  PINHD-1X6  [1X06]
R56  4.7k  R-EU_R0603  [R0603]
R57  4.7k  R-EU_R0603  [R0603]
R58  4.7k  R-EU_R0603  [R0603]
R59  4.7k  R-EU_R0603  [R0603]
R60  4.7k  R-EU_R0603  [R0603]
R61  4.7k  R-EU_R0603  [R0603]
R62  4.7k  R-EU_R0603  [R0603]
R63  4.7k  R-EU_R0603  [R0603]
X12  PINHD-1X2  [1X02]
X13  PINHD-1X2  [1X02]
X14  PINHD-1X2  [1X02]
X15  PINHD-1X2  [1X02]
X16  PINHD-1X2  [1X02]
X17  PINHD-1X2  [1X02]

### Nets
+3V3: JP1.6 ; also sheet 1,4
+5V: JP1.4 R56.2 R57.2 R58.2 R59.2 R60.2 R61.2 R62.2 R63.2 ; also sheet 1,2,3,4,5
+12V_PULSE: JP1.2 ; also sheet 1,2,4
+18V [+18V]: JP1.3 ; also sheet 1,2
CON0_SCL: R61.1 X12.2 ; also sheet 2,3
CON0_SDA: R60.1 X12.1 ; also sheet 2,3
CON1_SCL: R57.1 X13.2 ; also sheet 2,3
CON1_SDA: R56.1 X13.1 ; also sheet 2,3
CON2_SCL: R59.1 X15.2 ; also sheet 2,3
CON2_SDA: R58.1 X15.1 ; also sheet 2,3
GND: JP1.1 ; also sheet 1,2,3,4
RPI_RXD: X17.1 ; also sheet 4
RPI_RXD_HI: X14.1 ; also sheet 3,4
RPI_TXD: X17.2 ; also sheet 4
RPI_TXD_HI: X14.2 ; also sheet 3,4
UI_SCL: R63.1 X16.2 ; also sheet 3,4
UI_SDA: R62.1 X16.1 ; also sheet 3,4
ZERO_CROSSING: JP1.5 ; also sheet 3,4

### Notes on the sheet
- Voltage Pins
- Serial Communication Debug-Pins

## Library data of the parts
C1 C26-C28 C32-C34 = rcl:C-EU: CAPACITOR, European symbol; OC_MOUSER: 710-885012206059; SPICEPREFIX: C
C2 C4 = solderpi:C-EEVFK; OC_MOUSER: 667-EEV-FK1E332M
C3 = rcl:C-EU: CAPACITOR, European symbol; OC_MOUSER: 603-CC805KKX5R8BB225; SPICEPREFIX: C
C5 = rcl:C-EU: CAPACITOR, European symbol; OC_MOUSER: 963-QMK212SD151KD-T; SPICEPREFIX: C
C6 = rcl:C-EU: CAPACITOR, European symbol; OC_MOUSER: 963-TMK212ABJ475MG-T; SPICEPREFIX: C
C7-C10 = rcl:C-EU: CAPACITOR, European symbol; OC_MOUSER: 81-GRM219R71C684JA1D; SPICEPREFIX: C
C11 = rcl:C-EU: CAPACITOR, European symbol; OC_MOUSER: 81-GRM155R61C105MA2D; SPICEPREFIX: C
C12 C13 C15-C18 = rcl:C-EU: CAPACITOR, European symbol; OC_MOUSER: 710-885012105016; SPICEPREFIX: C
C14 C38 C39 = rcl:C-EU: CAPACITOR, European symbol; OC_MOUSER: 581-0805YD106MAT2A; SPICEPREFIX: C
C19 C20 = rcl:C-EU: CAPACITOR, European symbol; OC_MOUSER: 77-VJ0402A270JXJPBC; SPICEPREFIX: C
C21 C23 = rcl:C-EU: CAPACITOR, European symbol; OC_MOUSER: 710-885012005027; SPICEPREFIX: C
C22 = rcl:C-EU: CAPACITOR, European symbol; OC_MOUSER: 710-885012006023; SPICEPREFIX: C
C24 C25 = rcl:C-EU: CAPACITOR, European symbol; OC_MOUSER: 710-885012207072; SPICEPREFIX: C
C29-C31 C35-C37 = rcl:C-EU: CAPACITOR, European symbol; OC_MOUSER: 810-C1608X5R1E154K; SPICEPREFIX: C
CON1 CON2 = solderpi:BINDER-IP40
D1 = solderpi:MBR05020L; OC_MOUSER: 512-MBR0520L
IC1 = solderpi:LTC4357; OC_MOUSER: 584-LTC4357CMS8#PBF
IC2 = solderpi:LM1084; OC_MOUSER: 926-LM1084ISX50NOPB
IC3 = solderpi:LMR62014; OC_MOUSER: 926-LMR62014XMFENOPB
IC4-IC7 = solderpi:LM74670; OC_MOUSER: 595-LM74670QDGKRQ1
IC8 = solderpi:ATSAMC21J; OC_MOUSER: 556-ATSAMC21J18A-AUT
IC9 = solderpi:PCA9533; OC_MOUSER: 771-PCA9533DP/01-T
IC10 = solderpi:ST2378E; OC_MOUSER: 511-ST2378ET
IC11 = solderpi:AD5247BKSZ5-RL7; OC_MOUSER: 584-AD5247BKSZ5-R7
IC12 = solderpi:LT1803; OC_MOUSER: 584-LT1803CS5#TRMPBF
IC13-IC18 = solderpi:INA196; OC_MOUSER: 595-INA196AIDBVT
IC19 = solderpi:MIC5504
JP1 = solderpi:PINHD-1X6: PIN HEADER; OC_MOUSER: 855-M20-9990646
L1 = solderpi:WE-TPC; OC_MOUSER: 710-744042100
L2 = solderpi:L-0603; OC_MOUSER: 81-BLM18AG151SZ1D
Q1 = solderpi:7A-SERIES; OC_MOUSER: 717-7A-24.000MAAJ-T
Q2 = solderpi:9HT11; OC_MOUSER: 717-9HT11-32.7KDZC-T
R1 R32 R34 R36 R44 R46 R48 = rcl:R-EU_: RESISTOR, European symbol; OC_MOUSER: 71-CRCW0603-665K-E3; SPICEPREFIX: R
R2 R33 R35 R37 R45 R47 R49 = rcl:R-EU_: RESISTOR, European symbol; OC_MOUSER: 603-RC0603FR-10220KL; SPICEPREFIX: R
R3 = rcl:R-EU_: RESISTOR, European symbol; OC_MOUSER: 652-CR0805FX-1332ELF; SPICEPREFIX: R
R4 = rcl:R-EU_: RESISTOR, European symbol; OC_MOUSER: 71-CRCW0805-182K-E3; SPICEPREFIX: R
R5-R16 = rcl:R-EU_: RESISTOR, European symbol; OC_MOUSER: 652-CR0805-FX4701GLF; SPICEPREFIX: R
R17 = rcl:R-EU_: RESISTOR, European symbol; OC_MOUSER: 603-AC1210JR-070RL; SPICEPREFIX: R
R18 R21 R22 R24 R30 R56-R63 = rcl:R-EU_: RESISTOR, European symbol; OC_MOUSER: 603-RC0603FR-0710KL; SPICEPREFIX: R
R19 = rcl:R-EU_: RESISTOR, European symbol; OC_MOUSER: 603-RC0603FR-072K2L; SPICEPREFIX: R
R20 = rcl:R-EU_: RESISTOR, European symbol; OC_MOUSER: 594-MCT06030C3300FP5; SPICEPREFIX: R
R23 = rcl:R-EU_: RESISTOR, European symbol; OC_MOUSER: 71-CRCW0805-294-E3; SPICEPREFIX: R
R25 = rcl:R-EU_: RESISTOR, European symbol; OC_MOUSER: 284-APC0805B100KN; SPICEPREFIX: R
R26 = rcl:R-EU_: RESISTOR, European symbol; OC_MOUSER: 71-TNPW080541K7BEEA; SPICEPREFIX: R
R27 = rcl:R-EU_: RESISTOR, European symbol; OC_MOUSER: 279-CPF0805B24KE1; SPICEPREFIX: R
R28 = rcl:R-EU_: RESISTOR, European symbol; OC_MOUSER: 284-APC0805B200RN; SPICEPREFIX: R
R29 R31 = rcl:R-EU_: RESISTOR, European symbol; OC_MOUSER: 603-RC0805FR-07210RL; SPICEPREFIX: R
R38-R40 R50-R52 = rcl:R-EU_: RESISTOR, European symbol; OC_MOUSER: 791-WW12DR020FTL; SPICEPREFIX: R
R41-R43 R53-R55 = rcl:R-EU_: RESISTOR, European symbol; OC_MOUSER: 603-AC0603FR-071K1L; SPICEPREFIX: R
T1 = solderpi:FDS6670A; OC_MOUSER: 512-FDS6670A
T2-T5 = solderpi:PSMN1R0; OC_MOUSER: 771-PSMN1R0-30YLDX
T6 T7 T10 T11 T14 T16 = solderpi:NVR4003NT3G; OC_MOUSER: 863-NVR4003NT3G
T8 T9 T12 T13 T15 T17 = solderpi:IRF9392PBF; OC_MOUSER: 942-IRF9392TRPBF
T18 = solderpi:BSS7728NH6327XTSA1; OC_MOUSER: 726-BSS139H6327XTSA1
T19-T21 = solderpi:BSS84PH6433XTMA1; OC_MOUSER: 726-BSS84PH6327XTSA2
X1 = solderpi:ULTRAFIT-2; OC_MOUSER: 538-172286-1102, 538-172256-2102
X2-X4 = solderpi:NANOFIT-7; OC_MOUSER: 538-105313-1107, 538-105307-1207
X5 = solderpi:JTAG-EDGE-CON; OC_MOUSER: 649-1001878311110TLF
X6 = solderpi:B3S-1000; OC_FARNELL: 177807; OC_MOUSER: 653-B3S-1000
X7 = solderpi:IGRID-10; OC_MOUSER: 538-501645-1020, 538-501646-1000
X8 = con-molex:KK-156-2: KK 156 HEADER Source: http://www.molex.com/pdm_docs/sd/026604100_sd.pdf; MF: MOLEX; OC_FARNELL: unknown; OC_MOUSER: 538-22-27-2021, 538-22-01-2026,538-08-50-0032; OC_NEWARK: unknown
X9 = solderpi:MICRO-LATCH-4; OC_MOUSER: 538-53253-0470, 538-51065-0400
X10 = solderpi:IGRID-14; OC_MOUSER: 538-501645-1620, 538-501646-1600
X11 = solderpi:MICRO-CLASP-6; OC_MOUSER: 538-51382-0600, 538-55932-0610
X12-X17 = solderpi:PINHD-1X2: PIN HEADER; OC_MOUSER: 855-M20-9990246

## Net classes
0 µC: width 0.2 mm, drill 0.3 mm, clearance 0.2 mm
1 +18V: width 0.4 mm, drill 0.35 mm, clearance 0.3 mm